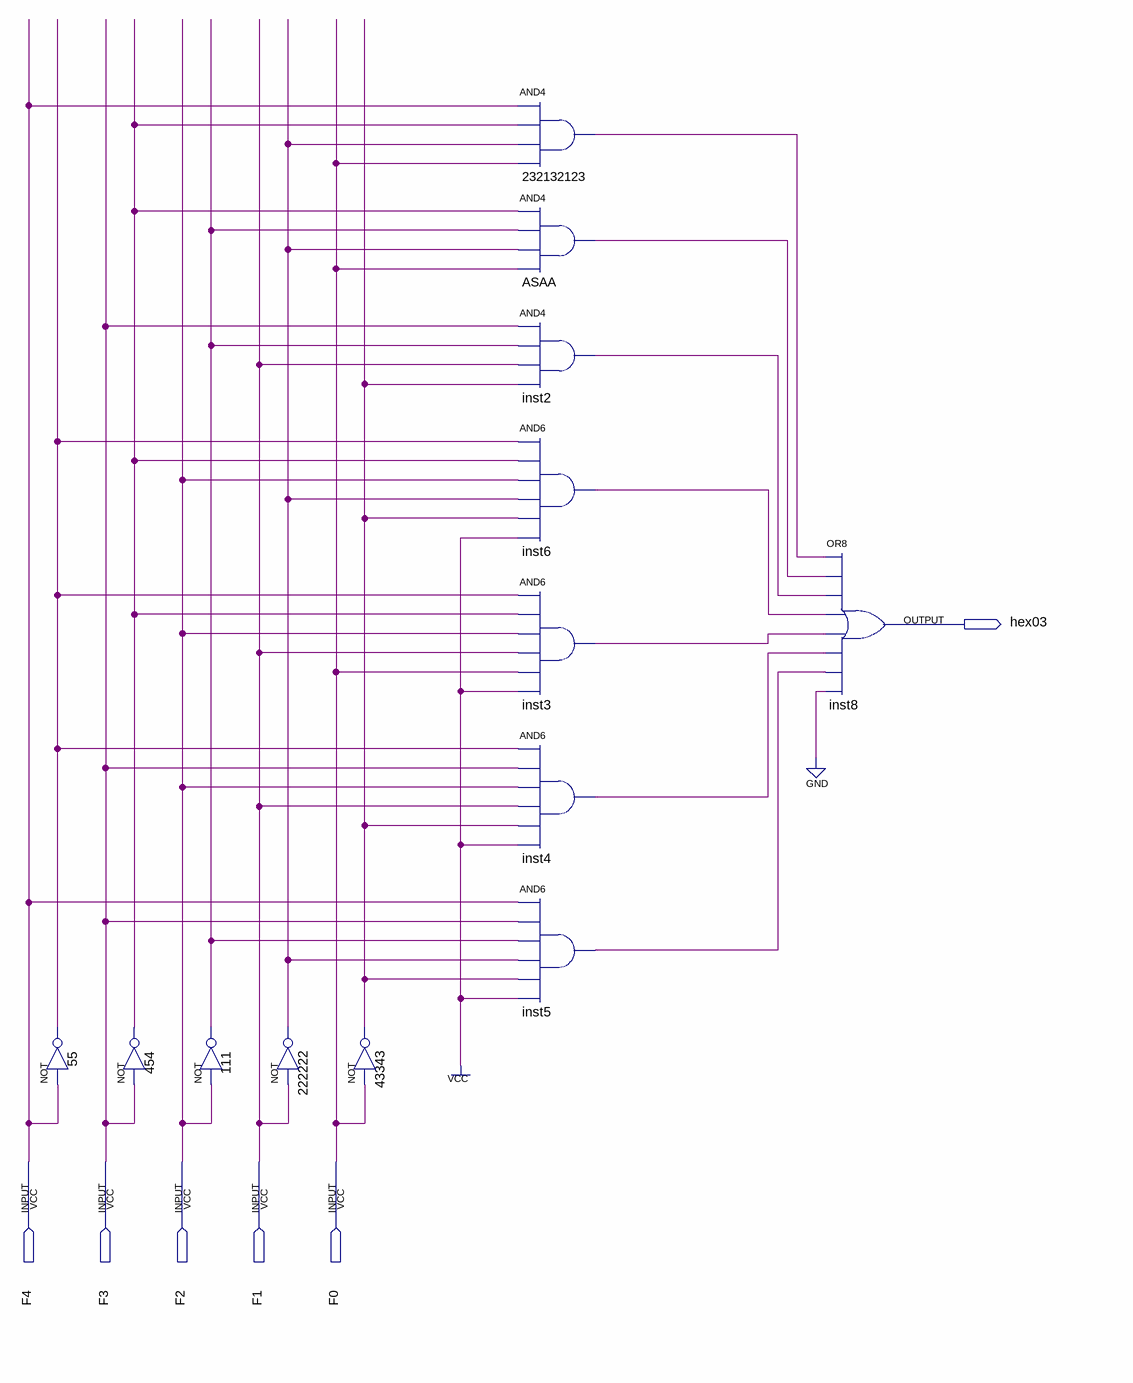
[diagram p0: schematic sheet]
// Quartus schematic HEX0[3].bdf as structural Verilog: 13 symbols, 6 pins
module \HEX0[3]  (
  input  F4,
  input  F3,
  input  F2,
  input  F1,
  input  F0,
  output hex03
);

  wire ASAA_out, inst2_out, inst3_out, inst4_out, inst5_out, inst6_out, n55_out, n111_out, n454_out,
       n43343_out, n222222_out, n232132123_out;

  not u_55 (n55_out, F4);
  not u_454 (n454_out, F3);
  not u_111 (n111_out, F2);
  not u_222222 (n222222_out, F1);
  not u_43343 (n43343_out, F0);
  and u_232132123 (n232132123_out, F4, n454_out, n222222_out, F0);
  and ASAA (ASAA_out, n454_out, n111_out, n222222_out, F0);
  and inst2 (inst2_out, F3, n111_out, F1, n43343_out);
  and inst6 (inst6_out, n55_out, n454_out, F2, n222222_out, n43343_out, 1'b1);
  and inst3 (inst3_out, n55_out, n454_out, F2, F1, F0, 1'b1);
  and inst4 (inst4_out, n55_out, F3, F2, F1, n43343_out, 1'b1);
  and inst5 (inst5_out, F4, F3, n111_out, n222222_out, n43343_out, 1'b1);
  or inst8 (hex03, n232132123_out, ASAA_out, inst2_out, inst6_out, inst3_out, inst4_out, inst5_out, 1'b0);
endmodule
